# Altium project control-cluster-test.PrjPCB
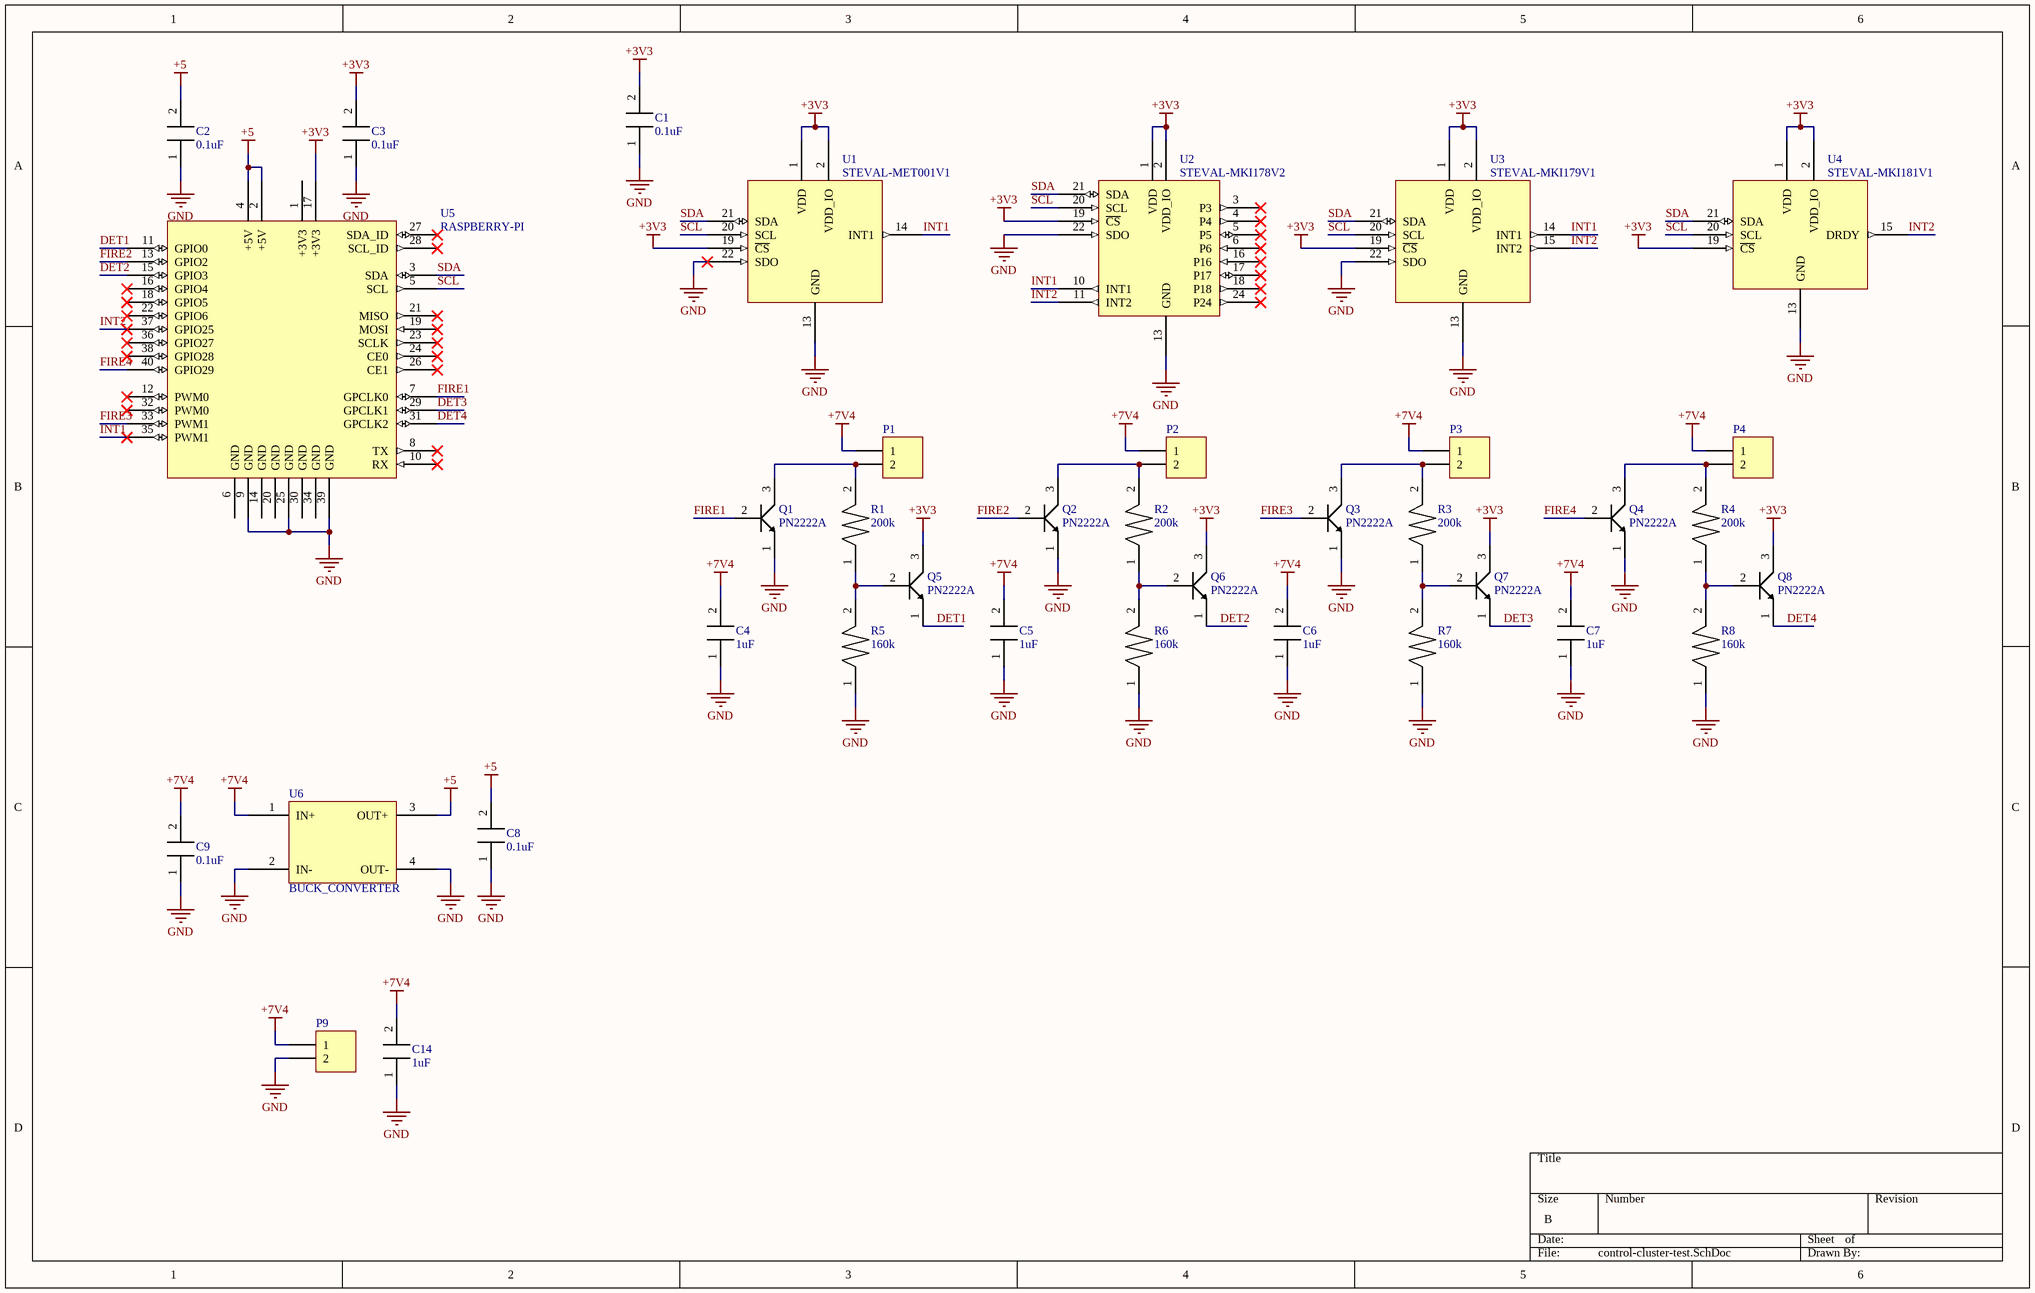
[diagram p0: control-cluster-test.SchDoc]
1 sheet, 37 parts. Net scope: global (net labels, ports and power ports of the same name join across sheets).
Board file: control-cluster-test.PcbDoc

## Sheet control-cluster-test.SchDoc
size B

### Parts
C1  0.1uF  [CAPACITOR]
C2  0.1uF  [CAPACITOR]
C3  0.1uF  [CAPACITOR]
C4  1uF  [CAPACITOR]
C5  1uF  [CAPACITOR]
C6  1uF  [CAPACITOR]
C7  1uF  [CAPACITOR]
C8  0.1uF  [CAPACITOR]
C9  0.1uF  [CAPACITOR]
C14  1uF  [CAPACITOR]
P1  Header 2  [HDR1X2]  (value not drawn)
P2  Header 2  [HDR1X2]  (value not drawn)
P3  Header 2  [HDR1X2]  (value not drawn)
P4  Header 2  [HDR1X2]  (value not drawn)
P9  Header 2  [HDR1X2]  (value not drawn)
Q1  PN2222A  [PN2222A]
Q2  PN2222A  [PN2222A]
Q3  PN2222A  [PN2222A]
Q4  PN2222A  [PN2222A]
Q5  PN2222A  [PN2222A]
Q6  PN2222A  [PN2222A]
Q7  PN2222A  [PN2222A]
Q8  PN2222A  [PN2222A]
R1  200k  [RESISTOR]
R2  200k  [RESISTOR]
R3  200k  [RESISTOR]
R4  200k  [RESISTOR]
R5  160k  [RESISTOR]
R6  160k  [RESISTOR]
R7  160k  [RESISTOR]
R8  160k  [RESISTOR]
U1  STEVAL-MET001V1  [STEVAL]
U2  STEVAL-MKI178V2  [STEVAL]
U3  STEVAL-MKI179V1  [STEVAL]
U4  STEVAL-MKI181V1  [STEVAL]
U5  RASPBERRY-PI  [RASPBERRY-PI]
U6  BUCK_CONVERTER  [BUCK_CONVERTER]

### Nets
+3V3: C1.2 C3.2 Q5.3(C) Q6.3(C) Q7.3(C) Q8.3(C) U1.1(VDD) U1.2(VDD_IO) U1.19(~{CS}) U2.1(VDD) U2.2(VDD_IO) U2.19(~{CS}) U3.1(VDD) U3.2(VDD_IO) U3.19(~{CS}) U4.1(VDD) U4.2(VDD_IO) U4.19(~{CS}) U5.17(+3V3)
+5: C2.2 C8.2 U5.2(+5V) U5.4(+5V) U6.3(OUT+)
+7V4: C4.2 C5.2 C6.2 C7.2 C9.2 C14.2 P1.1 P2.1 P3.1 P4.1 P9.1 U6.1(IN+)
GND: C1.1 C2.1 C3.1 C4.1 C5.1 C6.1 C7.1 C8.1 C9.1 C14.1 P9.2 Q1.1(E) Q2.1(E) Q3.1(E) Q4.1(E) R5.1 R6.1 R7.1 R8.1 U1.13(GND) U1.22(SDO) U2.13(GND) U2.22(SDO) U3.13(GND) U3.22(SDO) U4.13(GND) U5.9(GND) U5.25(GND) U5.39(GND) U6.2(IN-) U6.4(OUT-)
DET1: Q5.1(E) U5.11(GPIO0)
DET2: Q6.1(E) U5.15(GPIO3)
DET3: Q7.1(E) U5.29(GPCLK1)
DET4: Q8.1(E) U5.31(GPCLK2)
FIRE1: Q1.2(B) U5.7(GPCLK0)
FIRE2: Q2.2(B) U5.13(GPIO2)
FIRE3: Q3.2(B) U5.33(PWM1)
FIRE4: Q4.2(B) U5.40(GPIO29)
INT1: U1.14(INT1) U2.10(INT1) U3.14(INT1) U5.35(PWM1)
INT2: U2.11(INT2) U3.15(INT2) U4.15(DRDY) U5.37(GPIO25)
SCL: U1.20(SCL) U2.20(SCL) U3.20(SCL) U4.20(SCL) U5.5(SCL)
SDA: U1.21(SDA) U2.21(SDA) U3.21(SDA) U4.21(SDA) U5.3(SDA)
NetP1_2: P1.2 Q1.3(C) R1.2
NetP2_2: P2.2 Q2.3(C) R2.2
NetP3_2: P3.2 Q3.3(C) R3.2
NetP4_2: P4.2 Q4.3(C) R4.2
NetQ5_2: Q5.2(B) R1.1 R5.2
NetQ6_2: Q6.2(B) R2.1 R6.2
NetQ7_2: Q7.2(B) R3.1 R7.2
NetQ8_2: Q8.2(B) R4.1 R8.2

Not connected (* = marked no-connect by the designer): U2 3(P3)* 4(P4)* 5(P5)* 6(P6)* 16(P16)* 17(P17)* 18(P18)* 24(P24)*; U5 1(+3V3) 6(GND) 8(TX)* 10(RX)* 12(PWM0)* 14(GND) 16(GPIO4)* 18(GPIO5)* 19(MOSI)* 20(GND) 21(MISO)* 22(GPIO6)* 23(SCLK)* 24(CE0)* 26(CE1)* 27(SDA_ID)* 28(SCL_ID)* 30(GND) 32(PWM0)* 34(GND) 36(GPIO27)* 38(GPIO28)*

### Library data of the parts
C1-C9 C14 = CAPACITOR
P1-P4 P9 = Header 2: Header, 2-Pin; LatestRevisionDate: 17-Jul-2002; LatestRevisionNote: Re-released for DXP Platform.; Publisher: Altium Limited
R1-R8 = RESISTOR
U6 = BUCK_CONVERTER: ComponentLink1Description: amazon; ComponentLink1URL: https://www.amazon.com/MCIGICM-step-down-Converter-3-0-40V-1-5-35V/dp/B06XZ1DKF2